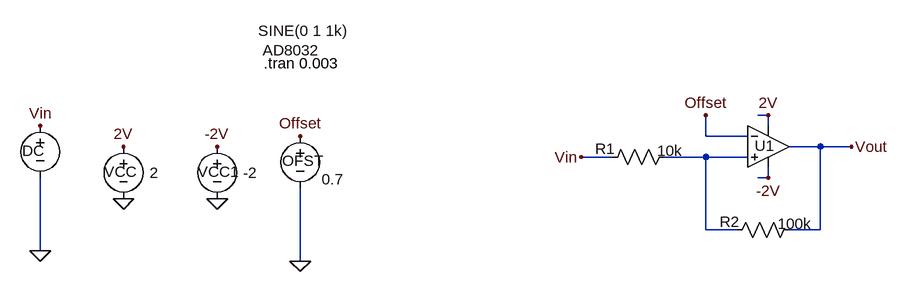
[diagram p0: schematic Schmitt trigger.asc]
Schmitt trigger.asc, the LTspice schematic file:
Version 4
SHEET 1 1288 680
WIRE 832 32 816 32
WIRE 832 48 832 32
WIRE 736 64 736 32
WIRE 800 64 736 64
WIRE 912 80 864 80
WIRE 960 80 912 80
WIRE 592 96 544 96
WIRE 736 96 672 96
WIRE 800 96 736 96
WIRE 832 128 832 112
WIRE 832 128 816 128
WIRE 736 208 736 96
WIRE 784 208 736 208
WIRE 912 208 912 80
WIRE 912 208 864 208
WIRE -288 240 -288 128
WIRE 112 256 112 144
FLAG -160 80 2V
FLAG -160 160 0
FLAG -288 240 0
FLAG -288 48 Vin
FLAG -16 160 0
FLAG 832 32 2V
FLAG 112 256 0
FLAG 112 64 Offset
FLAG 544 96 Vin
FLAG 960 80 Vout
FLAG -16 80 -2V
FLAG 832 128 -2V
FLAG 736 32 Offset
SYMBOL voltage -288 32 R0
WINDOW 123 0 0 Left 0
WINDOW 39 0 0 Left 0
WINDOW 0 -28 54 Left 2
WINDOW 3 335 -130 Left 2
SYMATTR InstName DC
SYMATTR Value SINE(0 1 1k)
SYMBOL voltage -160 64 R0
WINDOW 0 -30 55 Left 2
WINDOW 3 40 56 Left 2
WINDOW 123 0 0 Left 0
WINDOW 39 0 0 Left 0
SYMATTR InstName VCC
SYMATTR Value 2
SYMBOL voltage -16 64 R0
WINDOW 0 -30 55 Left 2
WINDOW 3 40 56 Left 2
WINDOW 123 0 0 Left 0
WINDOW 39 0 0 Left 0
SYMATTR InstName VCC1
SYMATTR Value -2
SYMBOL voltage 112 48 R0
WINDOW 123 0 0 Left 0
WINDOW 39 0 0 Left 0
WINDOW 0 -28 54 Left 2
WINDOW 3 33 82 Left 2
SYMATTR InstName OFST
SYMATTR Value 0.7
SYMBOL res 576 112 R270
WINDOW 0 13 5 VTop 2
WINDOW 3 41 105 VBottom 2
SYMATTR InstName R1
SYMATTR Value 10k
SYMBOL res 768 224 R270
WINDOW 0 13 5 VTop 2
WINDOW 3 41 105 VBottom 2
SYMATTR InstName R2
SYMATTR Value 100k
SYMBOL OpAmps\\AD8032 832 16 R0
WINDOW 0 -21 63 Left 2
WINDOW 3 -778 -84 Left 2
SYMATTR InstName U1
TEXT 56 -48 Left 2 !.tran 0.003

The netlist it stands for:
* Schmitt trigger.asc
V§DC Vin 0 SINE(0 1 1k)
VCC 2V 0 2
VCC1 -2V 0 -2
V§OFST Offset 0 0.7
R1 Vin N001 10k
R2 N001 Vout 100k
XU1 N001 Offset 2V -2V Vout AD8032  ; pins In+ In- V+ V- OUT
.tran 0.003
.backanno
.end